# Altium schematic sheet EStop.SchDoc
size A4
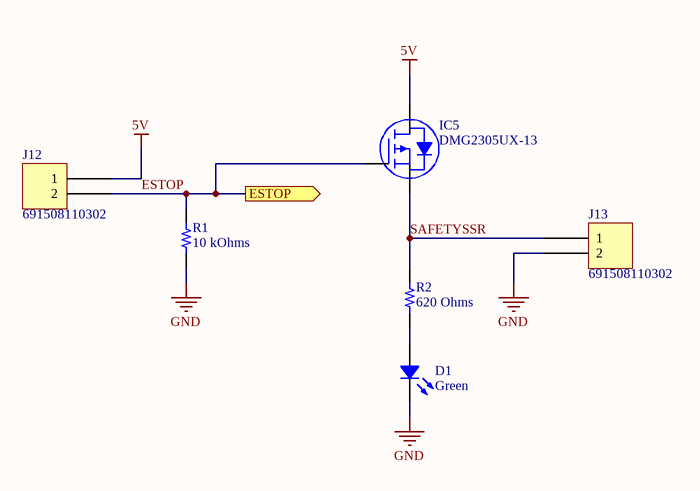
[diagram p0: EStop.SchDoc]

## Parts
D1  Green  [LED 0603_1608 GREEN]
IC5  DMG2305UX-13  [DIODES SOT-23-3]
J12  691508110302  [WURTH 691508110302]
J13  691508110302  [WURTH 691508110302]
R1  10 kOhms  [RES 0603_1608]
R2  620 Ohms  [RES 0603_1608]

## Ports
ESTOP (out)

## Nets
5V: IC5.3(D) J12.1
GND: D1.2 J13.2 R1.1
ESTOP: IC5.1(G) J12.2 R1.2 ; port ESTOP
SAFETYSSR: IC5.2(S) J13.1 R2.2
NetD1_1: D1.1 R2.1

## Notes on the sheet
- Title
- Size:
- Date:
- A4
- Number:
- Time:
- Revision:
- Sheet
- of
- File:

## Library data of the parts
D1 = LTST-C190KGKT: LED GREEN CLEAR CHIP SMD; Manufacturer: Lite-On Inc.; Configuration: Standard; Current - Test: 20mA; Lens Color: Colorless; Lens Size: 1.10mm x 0.80mm; Lens Style: Rectangle with Flat Top; Millicandela Rating: 35mcd; Viewing Angle: 130°; Voltage - Forward (Vf) (Typ): 2V; Wavelength - Dominant: 571nm; Wavelength - Peak: 574nm; Part Number: LTST-C190KGKT; Color: Green; ComponentLink1Description: Datasheet; ComponentLink1URL: http://optoelectronics.liteon.com/upload/download/DS22-2000-074/LTST-C190KGKT.PDF; ComponentLink2Description: DigiKey Link; ComponentLink2URL: http://digikey.com/product-detail/en/lite-on-inc/LTST-C190KGKT/160-1435-1-ND/386814; Device Package: 0603 (1608 Metric); Height (Max): 0.90mm; LastUpdated: 21/01/2020 03:12:09; Lens Transparency: Clear; Lifecycle Status: Active; Minimum Order: 1; Mounting Type: Surface Mount; Package / Case: 0603 (1608 Metric); Packaging: TapeAndReel; PartId: 657; Part Status: Active; Price: 0.04; Series: -; Size / Dimension: 1.60mm L x 0.80mm W; Supplier 1: DigiKey; Supplier Part Number 1: 160-1435-1-ND; Supplier Device Package: Chip LED; Value: Green
IC5 = DMG2305UX-13: MOSFET P-CH 20V 4.2A SOT23; Manufacturer: Diodes Incorporated; Current - Continuous Drain (Id) @ 25°C: 4.2A (Ta); Drive Voltage (Max Rds On,  Min Rds On): 1.8V, 4.5V; FET Type: P-Channel; Gate Charge (Qg) (Max) @ Vgs: 10.2nC @ 4.5V; Input Capacitance (Ciss) (Max) @ Vds: 808pF @ 15V; Power Dissipation (Max): 1.4W (Ta); Rds On (Max) @ Id, Vgs: 52mOhm @ 4.2A, 4.5V; Vgs (Max): ±8V; Vgs(th) (Max) @ Id: 900mV @ 250µA; Part Number: DMG2305UX-13; ComponentLink1Description: Datasheet; ComponentLink1URL: https://www.diodes.com/assets/Datasheets/DMG2305UX.pdf; ComponentLink2Description: DigiKey Link; ComponentLink2URL: http://digikey.com/product-detail/en/diodes-incorporated/DMG2305UX-13/DMG2305UX-13DICT-ND/4251589; Device Package: TO-236-3, SC-59, SOT-23-3; Drain to Source Voltage (Vdss): 20V; LastUpdated: 21/01/2020 04:00:37; Lifecycle Status: Active; Minimum Order: 1; Mounting Type: Surface Mount; Operating Temperature: -55°C ~ 150°C (TJ); Package / Case: TO-236-3, SC-59, SOT-23-3; Packaging: TapeAndReel; Part Status: Active; Price: 0.05; Series: -; Supplier 1: DigiKey; Supplier Part Number 1: DMG2305UX-13DICT-ND; Supplier Device Package: SOT-23; Technology: MOSFET (Metal Oxide)
J12 J13 = 691508110302: TERM BLOCK 2POS 3.5MM SMD; Manufacturer: Würth Elektronik; Current: 10A; Mating Orientation: Horizontal and Vertical with Board; Number of Levels: 1; Pitch: 0.138" (3.50mm); Positions Per Level: 2; Voltage: 300V; Wire Gauge: 16-30 AWG; Wire Termination: Screw - Rising Cage Clamp; Part Number: 691508110302; Color: Black; ComponentLink1Description: Datasheet; ComponentLink1URL: https://katalog.we-online.de/em/datasheet/6915081103xx.pdf; ComponentLink2Description: DigiKey Link; ComponentLink2URL: http://digikey.com/product-detail/en/w-rth-elektronik/691508110302/732-5963-1-ND/5047612; Features: Board Guide, Mounting Flange; LastUpdated: 15/01/2020 04:18:55; Lifecycle Status: Active; Minimum Order: 1; Mounting Type: Surface Mount; Packaging: TapeAndReel; Part Status: Active; Price: 1.57; Series: WR-TBL Series 5081; Supplier 1: DigiKey; Supplier Part Number 1: 732-5963-1-ND
R1 = ERJ-PA3J103V: RES SMD 10K OHM 5% 1/4W 0603; Manufacturer: Panasonic Electronic Components; Power (Watts): 0.25W, 1/4W; Temperature Coefficient: ±200ppm/°C; Part Number: ERJ-PA3J103V; Value: 10 kOhms; ComponentLink1Description: Datasheet; ComponentLink1URL: https://industrial.panasonic.com/cdbs/www-data/pdf/RDO0000/AOA0000C331.pdf; ComponentLink2Description: DigiKey Link; ComponentLink2URL: http://digikey.com/product-detail/en/panasonic-electronic-components/ERJ-PA3J103V/P10KBZCT-ND/5036237; Composition: Thick Film; Device Package: 0603 (1608 Metric); Features: Automotive AEC-Q200, Pulse Withstanding; Height - Seated (Max): 0.022" (0.55mm); LastUpdated: 21/01/2020 00:23:23; Lifecycle Status: Active; Minimum Order: 1; Number of Terminations: 2; Operating Temperature: -55°C ~ 155°C; Package / Case: 0603 (1608 Metric); Packaging: TapeAndReel; PartId: 8965; Part Status: Active; Price: 0.01; Ratings: AEC-Q200; Resistance: 10 kOhms; Series: ERJ; Size / Dimension: 0.063" L x 0.031" W (1.60mm x 0.80mm); Supplier 1: DigiKey; Supplier Part Number 1: P10KBZCT-ND; Supplier Device Package: 0603; Tolerance: ±5%
R2 = ERJ-3GEYJ621V: RES SMD 620 OHM 5% 1/10W 0603; Manufacturer: Panasonic Electronic Components; Power (Watts): 0.1W, 1/10W; Temperature Coefficient: ±200ppm/°C; Part Number: ERJ-3GEYJ621V; Value: 620 Ohms; ComponentLink1Description: Datasheet; ComponentLink1URL: http://industrial.panasonic.com/www-cgi/jvcr13pz.cgi?E+PZ+3+AOA0001+ERJ3GEYJ621V+7+WW; ComponentLink2Description: DigiKey Link; ComponentLink2URL: http://digikey.com/product-detail/en/panasonic-electronic-components/ERJ-3GEYJ621V/P620GCT-ND/134820; Composition: Thick Film; Device Package: 0603 (1608 Metric); Features: Automotive AEC-Q200; Height - Seated (Max): 0.022" (0.55mm); LastUpdated: 21/01/2020 00:23:40; Lifecycle Status: Active; Minimum Order: 1; Number of Terminations: 2; Operating Temperature: -55°C ~ 155°C; Package / Case: 0603 (1608 Metric); Packaging: TapeAndReel; PartId: 8112; Part Status: Active; Price: 0.01; Ratings: AEC-Q200; Resistance: 620 Ohms; Series: ERJ; Size / Dimension: 0.063" L x 0.031" W (1.60mm x 0.80mm); Supplier 1: DigiKey; Supplier Part Number 1: P620GCT-ND; Supplier Device Package: 0603; Tolerance: ±5%